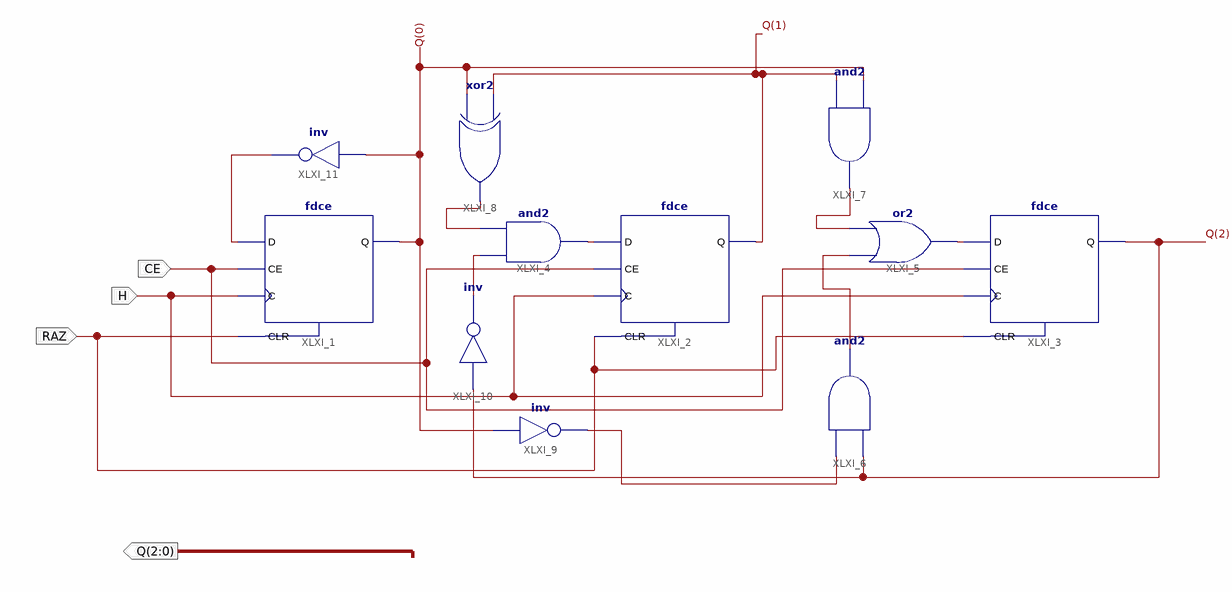
[diagram p0: schematic sheet 1]
// Xilinx ISE schematic compt_TM.sch (artix7) as structural Verilog: 11 symbols, 4 ports
module compt_TM (
  input  CE,
  input  H,
  input  RAZ,
  output [2:0] Q
);

  wire XLXN_102, XLXN_103, XLXN_104, XLXN_107, XLXN_108, XLXN_109, XLXN_110, XLXN_111;

  fdce XLXI_1 (.C(H), .CE(CE), .CLR(RAZ), .D(XLXN_110), .Q(Q[0]));
  fdce XLXI_2 (.C(H), .CE(CE), .CLR(RAZ), .D(XLXN_111), .Q(Q[1]));
  fdce XLXI_3 (.C(H), .CE(CE), .CLR(RAZ), .D(XLXN_103), .Q(Q[2]));
  and XLXI_4 (XLXN_111, XLXN_108, XLXN_107);
  or XLXI_5 (XLXN_103, XLXN_104, XLXN_102);
  and XLXI_6 (XLXN_104, Q[2], XLXN_109);
  and XLXI_7 (XLXN_102, Q[1], Q[0]);
  xor XLXI_8 (XLXN_107, Q[0], Q[1]);
  not XLXI_9 (XLXN_109, Q[0]);
  not XLXI_10 (XLXN_108, Q[2]);
  not XLXI_11 (XLXN_110, Q[0]);
endmodule
